# Altium project mod_duo_x.PrjPCB (part 3 of 3)
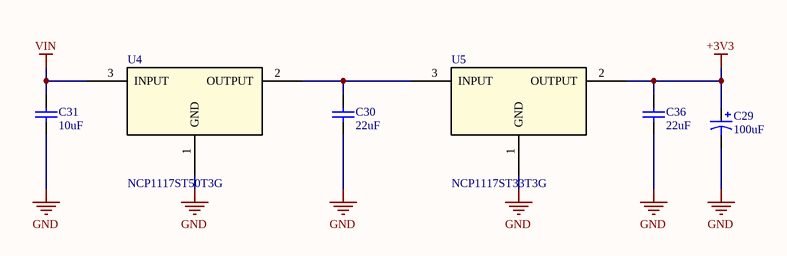
[diagram p8: [7]-POWER_DCDC_3V3.SchDoc]

## Nets that join several sheets
+3V3: U_[2]-BUTTONS_ILLUMINATION1 (R13A.2), U_[2]-BUTTONS_ILLUMINATION2 (R13B.2), U_[2]-BUTTONS_ILLUMINATION3 (R13C.2), U_[2]-BUTTONS_ILLUMINATION4 (R13D.2), U_[2]-BUTTONS_ILLUMINATION5 (R13E.2), U_[2]-BUTTONS_ILLUMINATION6 (R13F.2), U_[2]-BUTTONS_ILLUMINATION7 (R13G.2), [1]-MCU_LPC1777 (39 pins), U_[3]-ROTARY_ENCODER1 (R17A.2 R18A.2 R20A.2), U_[3]-ROTARY_ENCODER2 (R17B.2 R18B.2 R20B.2), [4]-DISPLAY_ERC12864FS (8 pins), [5]-PEAKMETER_LEDS (C28.1 R34.1 U3.25 U3.26), U_[6]-POTENTIOMETERS1 (VR1A.3), U_[6]-POTENTIOMETERS2 (VR1B.3), U_[6]-POTENTIOMETERS3 (VR1C.3), U_[6]-POTENTIOMETERS4 (VR1D.3), U_[6]-POTENTIOMETERS5 (VR1E.3), U_[6]-POTENTIOMETERS6 (VR1F.3), U_[6]-POTENTIOMETERS7 (VR1G.3), U_[6]-POTENTIOMETERS8 (VR1H.3), [7]-POWER_DCDC_3V3 (C29.1 C36.2 U5.2)
GND: U_[2]-BUTTONS_ILLUMINATION1 (8 pins), U_[2]-BUTTONS_ILLUMINATION2 (8 pins), U_[2]-BUTTONS_ILLUMINATION3 (8 pins), U_[2]-BUTTONS_ILLUMINATION4 (8 pins), U_[2]-BUTTONS_ILLUMINATION5 (8 pins), U_[2]-BUTTONS_ILLUMINATION6 (8 pins), U_[2]-BUTTONS_ILLUMINATION7 (8 pins), [1]-MCU_LPC1777 (49 pins), U_[3]-ROTARY_ENCODER1 (C16A.1 C17A.1 E1A.1 E1A.C), U_[3]-ROTARY_ENCODER2 (C16B.1 C17B.1 E1B.1 E1B.C), [4]-DISPLAY_ERC12864FS (30 pins), [5]-PEAKMETER_LEDS (21 pins), U_[6]-POTENTIOMETERS1 (VR1A.1), U_[6]-POTENTIOMETERS2 (VR1B.1), U_[6]-POTENTIOMETERS3 (VR1C.1), U_[6]-POTENTIOMETERS4 (VR1D.1), U_[6]-POTENTIOMETERS5 (VR1E.1), U_[6]-POTENTIOMETERS6 (VR1F.1), U_[6]-POTENTIOMETERS7 (VR1G.1), U_[6]-POTENTIOMETERS8 (VR1H.1), [7]-POWER_DCDC_3V3 (6 pins)
VIN: U_[2]-BUTTONS_ILLUMINATION1 (R14A.2 R15A.2 R16A.2), U_[2]-BUTTONS_ILLUMINATION2 (R14B.2 R15B.2 R16B.2), U_[2]-BUTTONS_ILLUMINATION3 (R14C.2 R15C.2 R16C.2), U_[2]-BUTTONS_ILLUMINATION4 (R14D.2 R15D.2 R16D.2), U_[2]-BUTTONS_ILLUMINATION5 (R14E.2 R15E.2 R16E.2), U_[2]-BUTTONS_ILLUMINATION6 (R14F.2 R15F.2 R16F.2), U_[2]-BUTTONS_ILLUMINATION7 (R14G.2 R15G.2 R16G.2), [1]-MCU_LPC1777 (5 pins), [7]-POWER_DCDC_3V3 (C31.2 U4.3)
ENC_A1: [1]-MCU_LPC1777 (U1.161), U_[3]-ROTARY_ENCODER1 (R21A.1)
ENC_A2: [1]-MCU_LPC1777 (U1.170), U_[3]-ROTARY_ENCODER2 (R21B.1)
ENC_B1: [1]-MCU_LPC1777 (U1.162), U_[3]-ROTARY_ENCODER1 (R19A.1)
ENC_B2: [1]-MCU_LPC1777 (U1.171), U_[3]-ROTARY_ENCODER2 (R19B.1)
ENC_SW1: [1]-MCU_LPC1777 (U1.163), U_[3]-ROTARY_ENCODER1 (E1A.2 R17A.1)
ENC_SW2: [1]-MCU_LPC1777 (U1.173), U_[3]-ROTARY_ENCODER2 (E1B.2 R17B.1)
GLCD_CD: [1]-MCU_LPC1777 (U1.109), [4]-DISPLAY_ERC12864FS (GLCD1.3 GLCD2.3)
GLCD_SCLK: [1]-MCU_LPC1777 (U1.128), [4]-DISPLAY_ERC12864FS (GLCD1.12 GLCD2.12)
GLCD_SI: [1]-MCU_LPC1777 (U1.124), [4]-DISPLAY_ERC12864FS (GLCD1.13 GLCD2.13)
LED_B1: U_[2]-BUTTONS_ILLUMINATION1 (Q4A.1 R46A.1), [1]-MCU_LPC1777 (U1.55)
LED_B2: U_[2]-BUTTONS_ILLUMINATION2 (Q4B.1 R46B.1), [1]-MCU_LPC1777 (U1.80)
LED_B3: U_[2]-BUTTONS_ILLUMINATION3 (Q4C.1 R46C.1), [1]-MCU_LPC1777 (U1.97)
LED_B4: U_[2]-BUTTONS_ILLUMINATION4 (Q4D.1 R46D.1), [1]-MCU_LPC1777 (U1.100)
LED_B5: U_[2]-BUTTONS_ILLUMINATION5 (Q4E.1 R46E.1), [1]-MCU_LPC1777 (U1.104)
LED_B6: U_[2]-BUTTONS_ILLUMINATION6 (Q4F.1 R46F.1), [1]-MCU_LPC1777 (U1.138)
LED_B7: U_[2]-BUTTONS_ILLUMINATION7 (Q4G.1 R46G.1), [1]-MCU_LPC1777 (U1.159)
LED_G1: U_[2]-BUTTONS_ILLUMINATION1 (Q3A.1 R27A.1), [1]-MCU_LPC1777 (U1.54)
LED_G2: U_[2]-BUTTONS_ILLUMINATION2 (Q3B.1 R27B.1), [1]-MCU_LPC1777 (U1.79)
LED_G3: U_[2]-BUTTONS_ILLUMINATION3 (Q3C.1 R27C.1), [1]-MCU_LPC1777 (U1.92)
LED_G4: U_[2]-BUTTONS_ILLUMINATION4 (Q3D.1 R27D.1), [1]-MCU_LPC1777 (U1.99)
LED_G5: U_[2]-BUTTONS_ILLUMINATION5 (Q3E.1 R27E.1), [1]-MCU_LPC1777 (U1.103)
LED_G6: U_[2]-BUTTONS_ILLUMINATION6 (Q3F.1 R27F.1), [1]-MCU_LPC1777 (U1.137)
LED_G7: U_[2]-BUTTONS_ILLUMINATION7 (Q3G.1 R27G.1), [1]-MCU_LPC1777 (U1.158)
LED_R1: U_[2]-BUTTONS_ILLUMINATION1 (Q2A.1 R24A.1), [1]-MCU_LPC1777 (U1.53)
LED_R2: U_[2]-BUTTONS_ILLUMINATION2 (Q2B.1 R24B.1), [1]-MCU_LPC1777 (U1.78)
LED_R3: U_[2]-BUTTONS_ILLUMINATION3 (Q2C.1 R24C.1), [1]-MCU_LPC1777 (U1.91)
LED_R4: U_[2]-BUTTONS_ILLUMINATION4 (Q2D.1 R24D.1), [1]-MCU_LPC1777 (U1.98)
LED_R5: U_[2]-BUTTONS_ILLUMINATION5 (Q2E.1 R24E.1), [1]-MCU_LPC1777 (U1.102)
LED_R6: U_[2]-BUTTONS_ILLUMINATION6 (Q2F.1 R24F.1), [1]-MCU_LPC1777 (U1.136)
LED_R7: U_[2]-BUTTONS_ILLUMINATION7 (Q2G.1 R24G.1), [1]-MCU_LPC1777 (U1.157)
NetGLCD1_1: [1]-MCU_LPC1777 (U1.129), [4]-DISPLAY_ERC12864FS (GLCD1.1)
NetGLCD1_2: [1]-MCU_LPC1777 (U1.127), [4]-DISPLAY_ERC12864FS (GLCD1.2)
NetGLCD2_1: [1]-MCU_LPC1777 (U1.106), [4]-DISPLAY_ERC12864FS (GLCD2.1)
NetGLCD2_2: [1]-MCU_LPC1777 (U1.107), [4]-DISPLAY_ERC12864FS (GLCD2.2)
NetQ5_1: [1]-MCU_LPC1777 (U1.108), [4]-DISPLAY_ERC12864FS (Q5.1)
NetQ6_1: [1]-MCU_LPC1777 (U1.105), [4]-DISPLAY_ERC12864FS (Q6.1)
PM_LEDS_OE: [1]-MCU_LPC1777 (P1.6 R2.1), [5]-PEAKMETER_LEDS (R34.2 U3.20)
PM_LEDS_SCL: [1]-MCU_LPC1777 (P1.7 R4.1), [5]-PEAKMETER_LEDS (U3.23)
PM_LEDS_SDA: [1]-MCU_LPC1777 (P1.8 R3.1), [5]-PEAKMETER_LEDS (U3.24)
POT1: [1]-MCU_LPC1777 (U1.18), U_[6]-POTENTIOMETERS1 (VR1A.2)
POT2: [1]-MCU_LPC1777 (U1.16), U_[6]-POTENTIOMETERS2 (VR1B.2)
POT3: [1]-MCU_LPC1777 (U1.14), U_[6]-POTENTIOMETERS3 (VR1C.2)
POT4: [1]-MCU_LPC1777 (U1.12), U_[6]-POTENTIOMETERS4 (VR1D.2)
POT5: [1]-MCU_LPC1777 (U1.42), U_[6]-POTENTIOMETERS5 (VR1E.2)
POT6: [1]-MCU_LPC1777 (U1.40), U_[6]-POTENTIOMETERS6 (VR1F.2)
POT7: [1]-MCU_LPC1777 (U1.41), U_[6]-POTENTIOMETERS7 (VR1G.2)
POT8: [1]-MCU_LPC1777 (U1.45), U_[6]-POTENTIOMETERS8 (VR1H.2)
SW1: U_[2]-BUTTONS_ILLUMINATION1 (R13A.1 SW2A.3 SW2A.4), [1]-MCU_LPC1777 (U1.56)
SW2: U_[2]-BUTTONS_ILLUMINATION2 (R13B.1 SW2B.3 SW2B.4), [1]-MCU_LPC1777 (U1.81)
SW3: U_[2]-BUTTONS_ILLUMINATION3 (R13C.1 SW2C.3 SW2C.4), [1]-MCU_LPC1777 (U1.83)
SW4: U_[2]-BUTTONS_ILLUMINATION4 (R13D.1 SW2D.3 SW2D.4), [1]-MCU_LPC1777 (U1.101)
SW5: U_[2]-BUTTONS_ILLUMINATION5 (R13E.1 SW2E.3 SW2E.4), [1]-MCU_LPC1777 (U1.135)
SW6: U_[2]-BUTTONS_ILLUMINATION6 (R13F.1 SW2F.3 SW2F.4), [1]-MCU_LPC1777 (U1.139)
SW7: U_[2]-BUTTONS_ILLUMINATION7 (R13G.1 SW2G.3 SW2G.4), [1]-MCU_LPC1777 (U1.160)

## Assembly variants
PRODUCTION: not fitted FID1 FID2 FID3 FID4 FID5 FID6